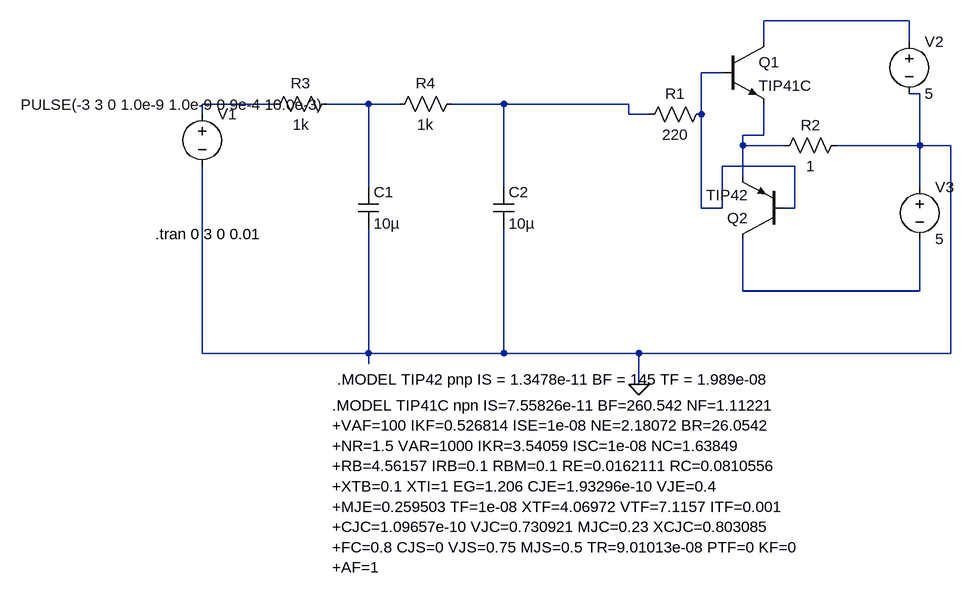
[diagram p0: schematic push-pull_pnp_pwm.asc]
push-pull_pnp_pwm.asc, the LTspice schematic file:
Version 4
SHEET 1 5104 848
WIRE 560 64 336 64
WIRE 336 96 336 64
WIRE 560 96 560 64
WIRE 272 144 240 144
WIRE 576 176 560 176
WIRE -416 192 -528 192
WIRE -272 192 -336 192
WIRE -224 192 -272 192
WIRE -64 192 -144 192
WIRE 128 192 -64 192
WIRE -528 208 -528 192
WIRE 128 208 128 192
WIRE 160 208 128 208
WIRE 240 208 240 144
WIRE 336 240 336 192
WIRE 336 240 304 240
WIRE 304 256 304 240
WIRE 368 256 304 256
WIRE 576 256 576 176
WIRE 576 256 448 256
WIRE 624 256 576 256
WIRE 384 288 272 288
WIRE 304 304 304 256
WIRE -272 320 -272 192
WIRE -64 320 -64 192
WIRE 576 320 576 256
WIRE 240 352 240 208
WIRE 272 352 272 288
WIRE 272 352 240 352
WIRE 384 352 384 288
WIRE 384 352 368 352
WIRE 304 480 304 400
WIRE 576 480 576 400
WIRE 576 480 304 480
WIRE -528 576 -528 288
WIRE -272 576 -272 384
WIRE -272 576 -528 576
WIRE -64 576 -64 384
WIRE -64 576 -272 576
WIRE 144 576 -64 576
WIRE 624 576 624 256
WIRE 624 576 144 576
WIRE -272 592 -272 576
WIRE 144 624 144 576
FLAG 144 624 0
SYMBOL voltage -528 192 R0
WINDOW 3 -279 1 Left 2
SYMATTR InstName V1
SYMATTR Value PULSE(-3 3 0 1.0e-9 1.0e-9 0.9e-4 10.0e-3)
SYMBOL voltage 560 80 R0
SYMATTR InstName V2
SYMATTR Value 5
SYMBOL voltage 576 304 R0
SYMATTR InstName V3
SYMATTR Value 5
SYMBOL res 256 192 R90
WINDOW 0 0 56 VBottom 2
WINDOW 3 32 56 VTop 2
SYMATTR InstName R1
SYMATTR Value 220
SYMBOL res 464 240 R90
WINDOW 0 0 56 VBottom 2
WINDOW 3 32 56 VTop 2
SYMATTR InstName R2
SYMATTR Value 1
SYMBOL npn 272 96 R0
SYMATTR InstName Q1
SYMATTR Value TIP41C
SYMBOL pnp 368 400 R180
SYMATTR InstName Q2
SYMATTR Value TIP42
SYMBOL res -320 176 R90
WINDOW 0 0 56 VBottom 2
WINDOW 3 32 56 VTop 2
SYMATTR InstName R3
SYMATTR Value 1k
SYMBOL res -128 176 R90
WINDOW 0 0 56 VBottom 2
WINDOW 3 32 56 VTop 2
SYMATTR InstName R4
SYMATTR Value 1k
SYMBOL cap -288 320 R0
SYMATTR InstName C1
SYMATTR Value 10µ
SYMBOL cap -80 320 R0
SYMATTR InstName C2
SYMATTR Value 10µ
TEXT -600 392 Left 2 !.tran 0 3 0 0.01
TEXT -328 656 Left 2 !.MODEL TIP41C npn IS=7.55826e-11 BF=260.542 NF=1.11221\n+VAF=100 IKF=0.526814 ISE=1e-08 NE=2.18072 BR=26.0542\n+NR=1.5 VAR=1000 IKR=3.54059 ISC=1e-08 NC=1.63849\n+RB=4.56157 IRB=0.1 RBM=0.1 RE=0.0162111 RC=0.0810556\n+XTB=0.1 XTI=1 EG=1.206 CJE=1.93296e-10 VJE=0.4\n+MJE=0.259503 TF=1e-08 XTF=4.06972 VTF=7.1157 ITF=0.001\n+CJC=1.09657e-10 VJC=0.730921 MJC=0.23 XCJC=0.803085\n+FC=0.8 CJS=0 VJS=0.75 MJS=0.5 TR=9.01013e-08 PTF=0 KF=0\n+AF=1
TEXT -320 616 Left 2 !.MODEL TIP42 pnp IS = 1.3478e-11 BF = 145 TF = 1.989e-08

The netlist it stands for:
* push-pull_pnp_pwm.asc
V1 N003 0 PULSE(-3 3 0 1.0e-9 1.0e-9 0.9e-4 10.0e-3)
V2 N001 0 5
V3 0 N007 5
R1 N002 N005 220
R2 0 N006 1
Q1 N001 N002 N006 0 TIP41C
Q2 N007 N002 N006 0 TIP42
R3 N004 N003 1k
R4 N005 N004 1k
C1 N004 0 10µ
C2 N005 0 10µ
.model NPN NPN
.model PNP PNP
.lib standard.bjt
.tran 0 3 0 0.01
.MODEL TIP41C npn IS=7.55826e-11 BF=260.542 NF=1.11221
+VAF=100 IKF=0.526814 ISE=1e-08 NE=2.18072 BR=26.0542
+NR=1.5 VAR=1000 IKR=3.54059 ISC=1e-08 NC=1.63849
+RB=4.56157 IRB=0.1 RBM=0.1 RE=0.0162111 RC=0.0810556
+XTB=0.1 XTI=1 EG=1.206 CJE=1.93296e-10 VJE=0.4
+MJE=0.259503 TF=1e-08 XTF=4.06972 VTF=7.1157 ITF=0.001
+CJC=1.09657e-10 VJC=0.730921 MJC=0.23 XCJC=0.803085
+FC=0.8 CJS=0 VJS=0.75 MJS=0.5 TR=9.01013e-08 PTF=0 KF=0
+AF=1
.MODEL TIP42 pnp IS = 1.3478e-11 BF = 145 TF = 1.989e-08
.backanno
.end